# Altium schematic sheet STM32_Circuit.SchDoc
size A4
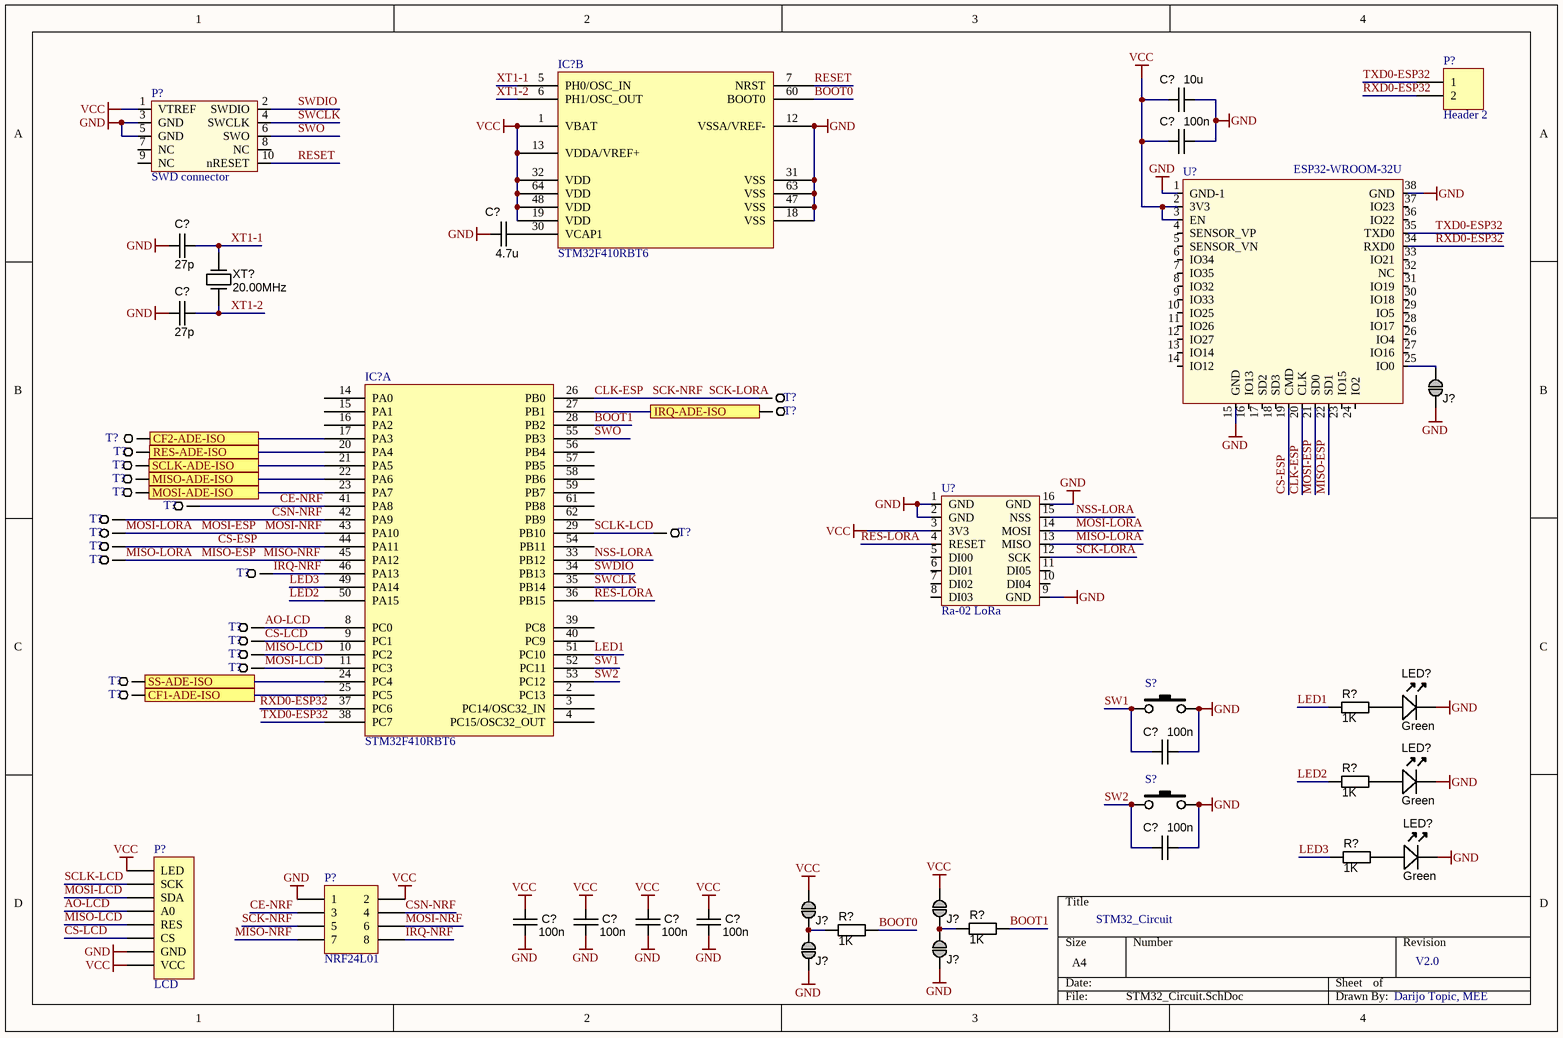
[diagram p0: STM32_Circuit.SchDoc]

## Parts
(Parts that share a designator on the sheet are numbered #1, #2 ... from top to bottom, then left to right.)
C?#1  value 10u  [CAPC2012X135N]  (hidden comment: approved sub OK)
C?#2  value 100n  [CAPC2012X135N]  (hidden comment: approved sub OK)
C?#3  value 4.7u  [CAPC2012X135N]  (hidden comment: approved sub OK)
C?#4  value 27p  [CAPC2012X135N]  (hidden comment: approved sub OK)
C?#5  value 27p  [CAPC2012X135N]  (hidden comment: approved sub OK)
C?#6  value 100n  [CAPC2012X135N]  (hidden comment: approved sub OK)
C?#7  value 100n  [CAPC2012X135N]  (hidden comment: approved sub OK)
C?#8  value 100n  [CAPC2012X135N]  (hidden comment: approved sub OK)
C?#9  value 100n  [CAPC2012X135N]  (hidden comment: approved sub OK)
C?#10  value 100n  [CAPC2012X135N]  (hidden comment: approved sub OK)
C?#11  value 100n  [CAPC2012X135N]  (hidden comment: approved sub OK)
IC?#1  STM32F410RBT6  [STM32F410RBT6]  (part B of 2)
IC?#2  STM32F410RBT6  [STM32F410RBT6]  (part A of 2)
J?#1  Jumper  [HDR1X2]  (value not drawn)  (no BOM)
J?#2  Jumper  [HDR1X2]  (value not drawn)  (no BOM)
J?#3  Jumper  [HDR1X2]  (value not drawn)  (no BOM)
J?#4  Jumper  [HDR1X2]  (value not drawn)  (no BOM)
J?#5  Jumper  [HDR1X2]  (value not drawn)  (no BOM)
LED?#1  Color: Green  [LED-0805-K]
LED?#2  Color: Green  [LED-0805-K]
LED?#3  Color: Green  [LED-0805-K]
P?#1  Header 2  [HDR1X2]
P?#2  SWD connector  [SWD connector]
P?#3  LCD  [HDR1X8]
P?#4  NRF24L01  [HDR2X4]
R?#1  value 1K  [RESC2012X70N]  (hidden comment: Thick Film)
R?#2  value 1K  [RESC2012X70N]  (hidden comment: Thick Film)
R?#3  value 1K  [RESC2012X70N]  (hidden comment: Thick Film)
R?#4  value 1K  [RESC2012X70N]  (hidden comment: Thick Film)
R?#5  value 1K  [RESC2012X70N]  (hidden comment: Thick Film)
S?#1  SMD_BUTTON  [SMD_BUTTON]  (value not drawn)
S?#2  SMD_BUTTON  [SMD_BUTTON]  (value not drawn)
T?#1  Test Point  [PIN1]  (value not drawn)
T?#2  Test Point  [PIN1]  (value not drawn)
T?#3  Test Point  [PIN1]  (value not drawn)
T?#4  Test Point  [PIN1]  (value not drawn)
T?#5  Test Point  [PIN1]  (value not drawn)
T?#6  Test Point  [PIN1]  (value not drawn)
T?#7  Test Point  [PIN1]  (value not drawn)
T?#8  Test Point  [PIN1]  (value not drawn)
T?#9  Test Point  [PIN1]  (value not drawn)
T?#10  Test Point  [PIN1]  (value not drawn)
T?#11  Test Point  [PIN1]  (value not drawn)
T?#12  Test Point  [PIN1]  (value not drawn)
T?#13  Test Point  [PIN1]  (value not drawn)
T?#14  Test Point  [PIN1]  (value not drawn)
T?#15  Test Point  [PIN1]  (value not drawn)
T?#16  Test Point  [PIN1]  (value not drawn)
T?#17  Test Point  [PIN1]  (value not drawn)
T?#18  Test Point  [PIN1]  (value not drawn)
T?#19  Test Point  [PIN1]  (value not drawn)
T?#20  Test Point  [PIN1]  (value not drawn)
U?#1  ESP32-WROOM-32U  [ESP32-WROOM-32U]
U?#2  Ra-02 LoRa  [Ra-02 LoRa]
XT?  20.00MHz  [CRYSTAL_HC49-US-SM]

## Ports
CF1-ADE-ISO, CF2-ADE-ISO, IRQ-ADE-ISO, MISO-ADE-ISO, MOSI-ADE-ISO, RES-ADE-ISO, SCLK-ADE-ISO, SS-ADE-ISO

## Nets
GND: C?#1.1 C?#2.1 C?#3.2 C?#4.1 C?#5.1 C?#6.1 C?#7.1 C?#8.2 C?#9.2 C?#10.2 C?#11.2 IC?#1.12(VSSA/VREF-) IC?#1.18(VSS) IC?#1.31(VSS) IC?#1.47(VSS) IC?#1.63(VSS) J?#1.2 J?#4.2 J?#5.2 LED?#1.K LED?#2.K LED?#3.K P?#2.3(GND) P?#2.5(GND) P?#3.7(GND) P?#4.1 S?#1.2 S?#2.2 U?#1.1(GND-1) U?#1.15(GND) U?#1.38(GND) U?#2.1(GND) U?#2.2(GND) U?#2.9(GND) U?#2.16(GND)
VCC: C?#1.2 C?#2.2 C?#8.1 C?#9.1 C?#10.1 C?#11.1 IC?#1.1(VBAT) IC?#1.13(VDDA/VREF+) IC?#1.19(VDD) IC?#1.32(VDD) IC?#1.48(VDD) IC?#1.64(VDD) J?#2.1 J?#3.1 P?#2.1(VTREF) P?#3.1(LED) P?#3.8(VCC) P?#4.2 U?#1.2(3V3) U?#1.3(EN) U?#2.3(3V3)
AO-LCD: IC?#2.8(PC0) P?#3.4(A0) T?#15.1
BOOT0: IC?#1.60(BOOT0) R?#4.2
BOOT1: IC?#2.28(PB2) R?#5.2
CE-NRF: IC?#2.41(PA8) P?#4.3 T?#8.1
CF1-ADE-ISO: IC?#2.25(PC5) T?#20.1 ; port CF1-ADE-ISO
CF2-ADE-ISO: IC?#2.17(PA3) T?#3.1 ; port CF2-ADE-ISO
CLK-ESP: IC?#2.26(PB0) P?#4.5 T?#1.1 U?#1.20(CLK) U?#2.12(SCK)  [also labelled SCK-LORA, SCK-NRF]
CS-ESP: IC?#2.44(PA11) T?#12.1 U?#1.19(CMD)
CS-LCD: IC?#2.9(PC1) P?#3.6(CS) T?#16.1
CSN-NRF: IC?#2.42(PA9) P?#4.4 T?#9.1
IRQ-ADE-ISO: IC?#2.27(PB1) T?#2.1 ; port IRQ-ADE-ISO
IRQ-NRF: IC?#2.46(PA13) P?#4.8 T?#14.1
LED1: IC?#2.51(PC10) R?#1.1
LED2: IC?#2.50(PA15) R?#2.1
LED3: IC?#2.49(PA14) R?#3.1
MISO-ADE-ISO: IC?#2.22(PA6) T?#6.1 ; port MISO-ADE-ISO
MISO-ESP: IC?#2.45(PA12) P?#4.7 T?#13.1 U?#1.22(SD1) U?#2.13(MISO)  [also labelled MISO-LORA, MISO-NRF]
MISO-LCD: IC?#2.10(PC2) P?#3.5(RES) T?#17.1
MOSI-ADE-ISO: IC?#2.23(PA7) T?#7.1 ; port MOSI-ADE-ISO
MOSI-ESP: IC?#2.43(PA10) P?#4.6 T?#10.1 U?#1.21(SD0) U?#2.14(MOSI)  [also labelled MOSI-LORA, MOSI-NRF]
MOSI-LCD: IC?#2.11(PC3) P?#3.3(SDA) T?#18.1
NSS-LORA: IC?#2.33(PB12) U?#2.15(NSS)
RES-ADE-ISO: IC?#2.20(PA4) T?#4.1 ; port RES-ADE-ISO
RES-LORA: IC?#2.36(PB15) U?#2.4(RESET)
RESET: IC?#1.7(NRST) P?#2.10(nRESET)
RXD0-ESP32: IC?#2.37(PC6) P?#1.2 U?#1.34(RXD0)
SCLK-ADE-ISO: IC?#2.21(PA5) T?#5.1 ; port SCLK-ADE-ISO
SCLK-LCD: IC?#2.29(PB10) P?#3.2(SCK) T?#11.1
SS-ADE-ISO: IC?#2.24(PC4) T?#19.1 ; port SS-ADE-ISO
SW1: C?#6.2 IC?#2.52(PC11) S?#1.1
SW2: C?#7.2 IC?#2.53(PC12) S?#2.1
SWCLK: IC?#2.35(PB14) P?#2.4(SWCLK)
SWDIO: IC?#2.34(PB13) P?#2.2(SWDIO)
SWO: IC?#2.55(PB3) P?#2.6(SWO)
TXD0-ESP32: IC?#2.38(PC7) P?#1.1 U?#1.35(TXD0)
XT1-1: C?#4.2 IC?#1.5(PH0/OSC_IN) XT?.2(OUT)
XT1-2: C?#5.2 IC?#1.6(PH1/OSC_OUT) XT?.1(IN)
NetC?#3_1: C?#3.1 IC?#1.30(VCAP1)
NetJ?#1_1: J?#1.1 U?#1.25(IO0)
NetJ?#2_2: J?#2.2 J?#4.1 R?#4.1
NetJ?#3_2: J?#3.2 J?#5.1 R?#5.1
NetLED?#1_A: LED?#1.A R?#1.2
NetLED?#2_A: LED?#2.A R?#2.2
NetLED?#3_A: LED?#3.A R?#3.2

Not connected (* = marked no-connect by the designer): IC?#2 2(PC13) 3(PC14/OSC32_IN) 4(PC15/OSC32_OUT) 14(PA0) 15(PA1) 16(PA2) 39(PC8) 40(PC9) 54(PB11) 56(PB4) 57(PB5) 58(PB6) 59(PB7) 61(PB8) 62(PB9); P?#2 7(NC) 8(NC) 9(NC); U?#1 4(SENSOR_VP) 5(SENSOR_VN) 6(IO34) 7(IO35) 8(IO32) 9(IO33) 10(IO25) 11(IO26) 12(IO27) 13(IO14) 14(IO12) 16(IO13) 17(SD2) 18(SD3) 23(IO15) 24(IO2) 26(IO4) 27(IO16) 28(IO17) 29(IO5) 30(IO18) 31(IO19) 32(NC) 33(IO21) 36(IO22) 37(IO23); U?#2 5(DI00) 6(DI01) 7(DI02) 8(DI03) 10(DI04) 11(DI05)

## Notes on the sheet
- STM32_Circuit
- V2.0
- Darijo Topic, MEE

## Library data of the parts
C?#1-C?#3 C?#6-C?#11 = CAPC_100n_0805_X7R_50V_10%: Capacitor SMD Cer 100nF 10% 50V X7R 0805; Manufacturer 1: Kemet; Manufacturer Part Number 1: C0805C104K5RACTU; Ratings: 50V; X7R; Material: ceramic; SCDType: undef; Package / Case: 0805 (2012 metric); Tolerance: ±10%; Supplier 1: Digi-Key; Supplier Part Number 1: 399-1170-1-ND
C?#4 C?#5 = CAPC_27p_0805_NP0_50V_5%: Capacitor SMD Cer 27pF 5% 50V NP0 0805; Manufacturer 1: Panasonic - ECG; Manufacturer Part Number 1: ECJ-2VC1H270J; Ratings: 50V; NP0; SCDType: undef; Tolerance: ±5%; Operating Temperature: -55°C ~ 125°C; Package / Case: 0805 (2012 metric); Supplier 1: Digi-Key; Supplier Part Number 1: PCC270CGCT-ND
IC?#1 IC?#2 = STM32F410RBT6: Manufacturer: STMICROELECTRONICS; Manufacturer Part No: STM32F410RBT6; Component Type: IC; Order Code: *; Supplier: *
J?#1-J?#5 = JUMP1: SMD jumper
LED?#1-LED?#3 = LED_SMD_Green_0805_6mcd: LED, 0805 SMD, Green; Manufacturer 1: LITE-ON; Manufacturer Part Number 1: LTST-C171GKT; Material: GaP; Ratings: 6 mcd; 569 nm; SCDType: source; Package / Case: 0805; Supplier 1: Digi-Key; Supplier Part Number 1: 160-1423-1-ND; Value: Green
P?#1 = Header 2: Header, 2-Pin; LatestRevisionDate: 17-Jul-2002; LatestRevisionNote: Re-released for DXP Platform.; Publisher: Altium Limited
P?#2 = SW_debug
P?#3 = Header 8: Header, 8-Pin; LatestRevisionDate: 17-Jul-2002; LatestRevisionNote: Re-released for DXP Platform.; Publisher: Altium Limited
P?#4 = Header 4X2: Header, 4-Pin, Dual row; LatestRevisionDate: 17-Jul-2002; LatestRevisionNote: Re-released for DXP Platform.; Publisher: Altium Limited
R?#1-R?#5 = RES_1K_0805_1%: Resistor SMD chip 1k Ohm 0.125W 1% 0805; Manufacturer 1: Vishay/Dale; Manufacturer Part Number 1: CRCW08051K00FKEA; Ratings: 1/8W; SCDType: spec; Supplier 1: Digi-Key; Supplier Part Number 1: 541-1.00KCCT-ND; Package / Case: 0805 (2012 metric); Tolerance: ±1%
T?#1-T?#20 = Test_Point
U?#1 = ESP32-WROOM-32U: Wi-Fi+BT+BLE MCU modules; Mouser: 356-ES32WROOM32U16MB; ComponentLink1Description: Espressif; ComponentLink1URL: https://hr.mouser.com/datasheet/2/891/esp32-wroom-32d_esp32-wroom-32u_datasheet_en-1365844.pdf
XT? = Crystal_6MHz_HC49/US: Resonator Ceramic 6.00 MHz 30ppm; Manufacturer 1: CTS-Frequency Controls; Manufacturer Part Number 1: ATS060BSM-1; Frequency: 6MHz; Frequency Stability: ±50ppm; Load Capacitance: 18pF; Operating Mode: Fundamental; Parameter Name: 0.169" (4.30mm); SCDType: spec; Package / Case: HC49/US-SM; Ratings: 6.00 MHz; Supplier 1: Digi-Key; Supplier Part Number 1: CTX882CT-ND; Type: MHz Crystal; Frequency Tolerance: ±30ppm; Operating Temperature: -20°C ~ 70°C; Mounting Type: Surface Mount; Size / Dimension: 0.437" L x 0.190" W (11.10mm x 4.83mm); ComponentLink1URL: http://www.ctscorp.com/components/Datasheets/008-0309-0.pdf; ComponentLink1Description: http://www.ctscorp.com/components/Datasheets/008-0309-0.pdf